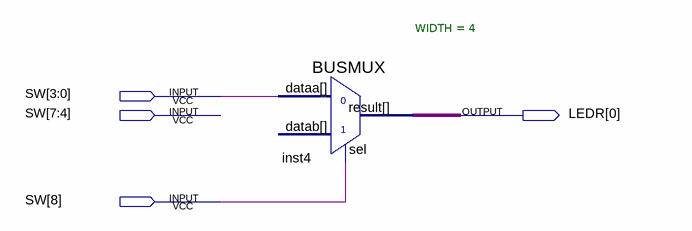
[diagram p0: schematic sheet]
// Quartus schematic mux_2_a_1.bdf as structural Verilog: 1 symbols, 4 pins
module mux_2_a_1 (
  input  [8:0] SW,
  output [0:0] LEDR
);

  wire undriven;
  wire [3:0] inst4_result;

  BUSMUX #(.WIDTH(4)) inst4 (.sel(SW[8]), .dataa({4{undriven}}), .result(inst4_result));  // open: datab
endmodule
